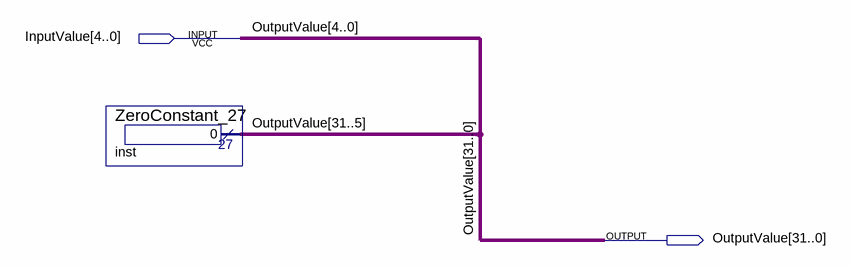
[diagram p0: schematic sheet]
// Quartus schematic ZeroExtensor_Shamt.bdf as structural Verilog: 1 symbols, 2 pins
module ZeroExtensor_Shamt (
  input  [4:0] InputValue,
  output [31:0] OutputValue
);

  ZeroConstant_27 inst (.result(OutputValue[31:5]));

  assign OutputValue[4:0] = InputValue;
endmodule
